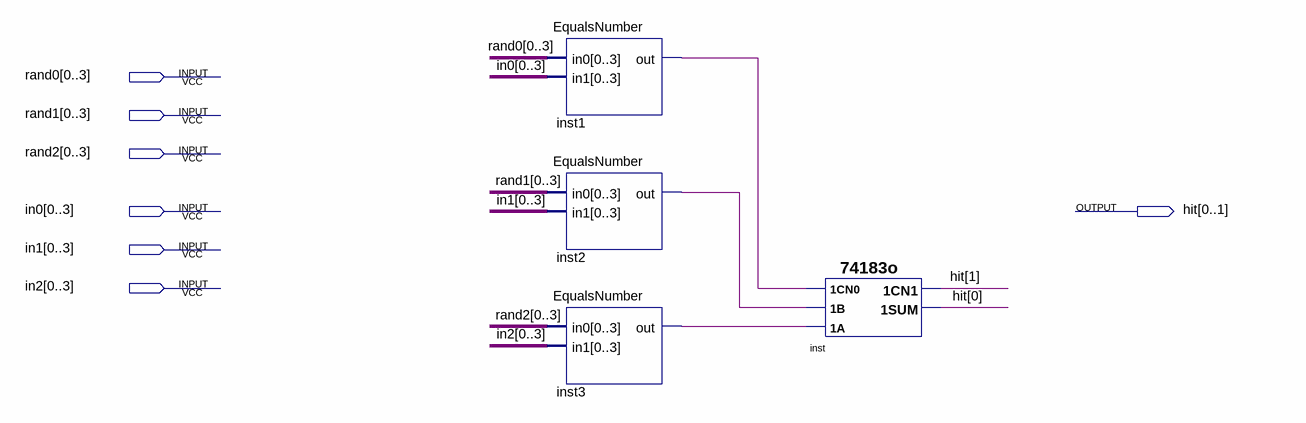
[diagram p0: schematic sheet]
// Quartus schematic CheckHit.bdf as structural Verilog: 4 symbols, 7 pins
module CheckHit (
  input  [0:3] rand0,
  input  [0:3] rand1,
  input  [0:3] rand2,
  input  [0:3] in0,
  input  [0:3] in1,
  input  [0:3] in2,
  output [0:1] hit
);

  wire inst1_out, inst2_out, inst3_out;

  EqualsNumber inst1 (.in0(rand0), .in1(in0), .out(inst1_out));
  EqualsNumber inst2 (.in0(rand1), .in1(in1), .out(inst2_out));
  EqualsNumber inst3 (.in0(rand2), .in1(in2), .out(inst3_out));
  \74183o  inst (.\1CN0 (inst1_out), .\1A (inst3_out), .\1B (inst2_out), .\1CN1 (hit[1]), .\1SUM (hit[0]));
endmodule
